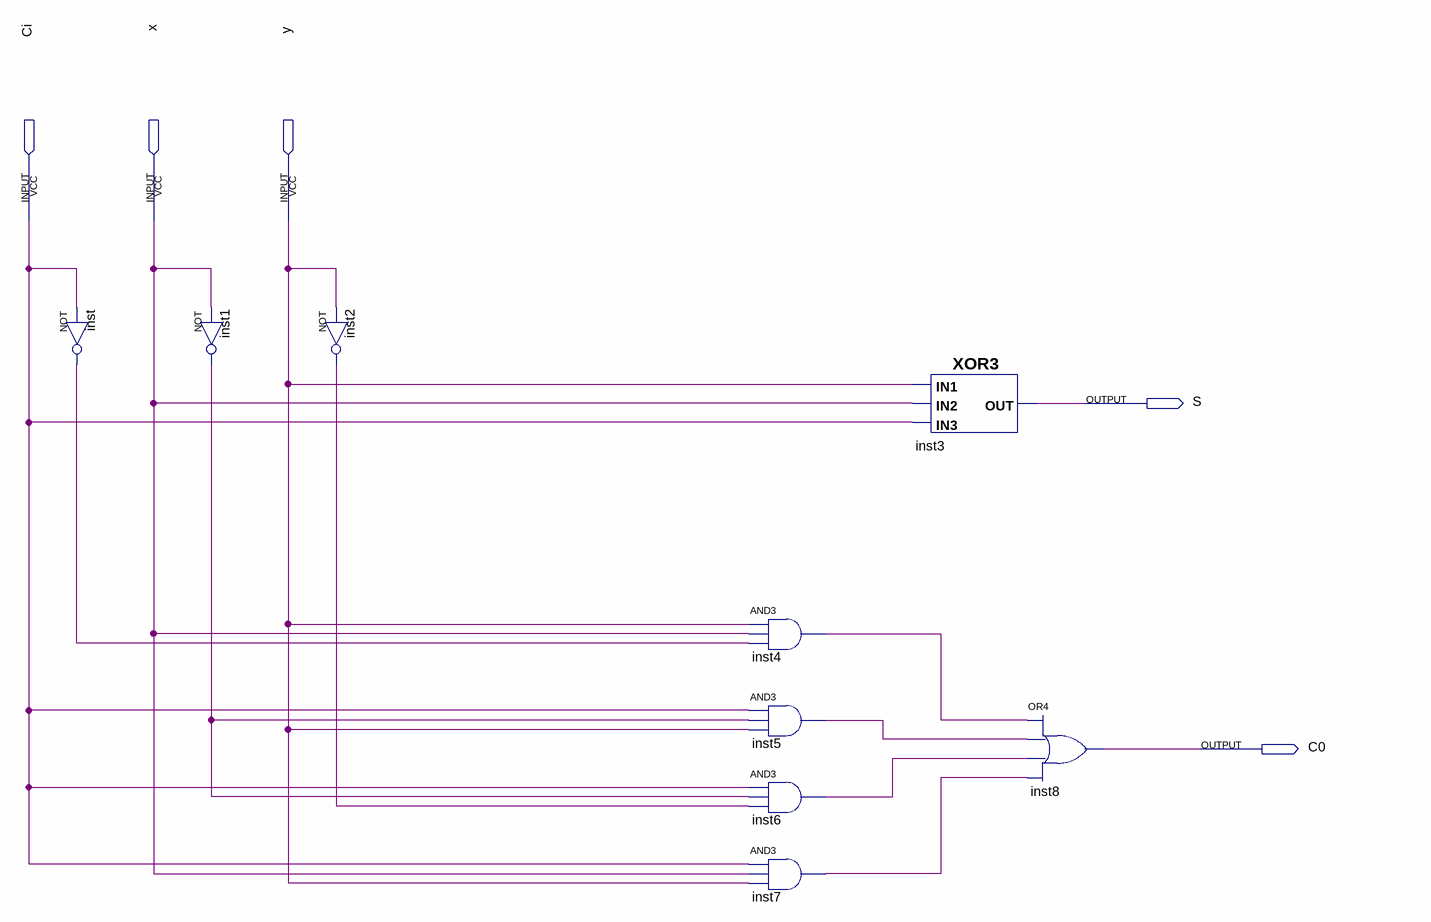
[diagram p0: schematic sheet]
// Quartus schematic Full_Adder.bdf as structural Verilog: 9 symbols, 5 pins
module Full_Adder (
  input  Ci,
  input  x,
  input  y,
  output S,
  output C0
);

  wire inst1_out, inst2_out, inst4_out, inst5_out, inst6_out, inst7_out, inst_out;

  not inst (inst_out, Ci);
  not inst1 (inst1_out, x);
  not inst2 (inst2_out, y);
  and inst4 (inst4_out, y, x, inst_out);
  and inst5 (inst5_out, Ci, inst1_out, y);
  and inst6 (inst6_out, Ci, inst1_out, inst2_out);
  and inst7 (inst7_out, Ci, x, y);
  XOR3 inst3 (.IN3(Ci), .IN1(y), .IN2(x), .OUT(S));
  or inst8 (C0, inst4_out, inst5_out, inst6_out, inst7_out);
endmodule
